# EAGLE design stab12V (EAGLE 5.05)
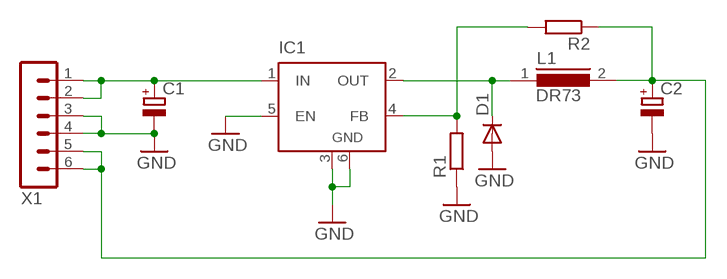
[diagram p0: schematic, sheet 1]

## Parts
C1  CPOL-EUSMCD  [SMC_D]
C2  CPOL-EUSMCD  [SMC_D]
D1  DIODE-SMC  [SMC]
IC1  LM2596S  [TO263-5]
L1  DR73  [DR73]
R1  R-EU_R0805  [R0805]
R2  R-EU_R0805  [R0805]
X1  MA06-1  [MA06-1]

## Nets
GND: C1.- C2.- D1.A IC1.3(GND) IC1.5(EN) IC1.6(GND) R1.1 X1.3 X1.4
N$1: C1.+ IC1.1(IN) X1.1 X1.2
N$2: IC1.4(FB) R1.2 R2.2
N$3: C2.+ L1.2 R2.1 X1.5 X1.6
N$4: D1.C IC1.2(OUT) L1.1

## Library data of the parts
C1 C2 = rcl:CPOL-EU: POLARIZED CAPACITOR, European symbol
D1 = diode:DIODE-: DIODE
IC1 = linear:LM2596S: STEP-DOWN VOLTAGE REGULATOR
L1 = inductors:DR73: High Power Density, High Efficiency, Shielded Inductors Source: coiltronics_dr_series.pdf
R1 R2 = rcl:R-EU_: RESISTOR, European symbol
X1 = con-lstb:MA06-1: PIN HEADER

## Board
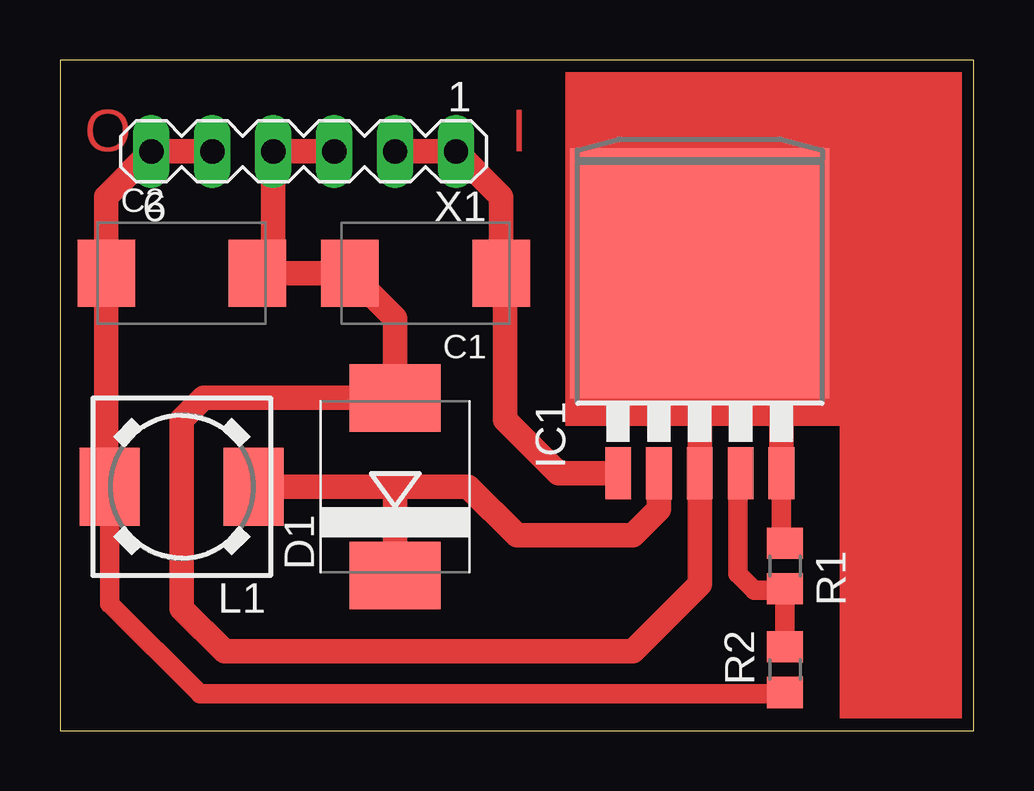
[diagram p1: board, top side]

Size 38.1 x 27.94 mm. Coordinates in mm from the lower left corner, seen from the top.
Outline: 0,0 38.1,0 38.1,27.94 0,27.94 0,0
Copper layers (1*16): Top 0.035mm / dielectric 1.5mm / Bottom 0.035mm
Design rules "default": minimum track width 10mil, minimum drill 24mil, track to track 8mil, track to pad 8mil, pad to pad 8mil, via to via 8mil, smd to smd 8mil, copper to edge 40mil, drill to drill 8mil, minimum pad ring 10mil, minimum via ring 8mil, stop-mask expansion 4mil, vias tented up to drill 0mil, thermal gap 10mil

### Footprints (pad centres in the part's own frame; a part is rotated, then mirrored left to right if it is on the bottom)
SMC_D = smd 2.4 x 2.8: + -3.15,0; - 3.15,0
SMC = smd 2.8 x 3.8: A 3.7,0; C -3.7,0
TO263-5 = smd 1.067 x 2.159: 1 -3.404,-5.791; 2 -1.702,-5.791; 3 0,-5.791; 4 1.702,-5.791; 5 3.404,-5.791 | smd 10.8 x 10.41: 6 0,2.54
DR73 = smd 2.5 x 3.25: 1 -3,0; 2 3,0
R0805 = smd 1.3 x 1.5: 1 -0.95,0; 2 0.95,0
MA06-1 = drill 1.016 long: 1 -6.35,0; 2 -3.81,0; 3 -1.27,0; 4 1.27,0; 5 3.81,0; 6 6.35,0

### Placement (x,y rotation side)
C1  15.24,19.05 180 top
C2  5.08,19.05 0 top
D1  13.97,10.16 90 top
IC1  26.67,16.51 0 top
L1  5.08,10.16 180 top
R1  30.23,6.86 270 top
R2  30.23,2.54 90 top
X1  10.16,24.13 180 top

### Tracks (layer width: path | path; a pad name or v marks a point on that pad's centre or on a via)
GND
  Top 0.813: IC1.5 30.07,7.96 R1.1
  Top 1.016: C1.- C2.- | C1.- 8.89,19.05 X1.4 X1.3 | C1.- 13.97,17.17 D1.A 5.99,13.86 5.08,12.95 5.08,5.08 6.86,3.3 23.88,3.3 26.67,6.1 IC1.3 IC1.6 29.72,19.05 30.07,18.69 IC1.5
N$1
  Top 1.016: X1.2 X1.1 18.39,22.25 C1.+ 18.54,18.9 18.54,12.95 20.78,10.72 IC1.1
N$2
  Top 0.813: IC1.4 28.26,10.61 28.26,6.54 28.96,5.84 30.16,5.84 R1.2 R2.2
N$3
  Top 0.813: L1.2 2.08,5.29 5.84,1.52 30.16,1.52 R2.1
  Top 1.016: L1.2 1.93,10.31 C2.+ 1.93,22.25 X1.6 X1.5
N$4
  Top 1.016: 10.27,10.16 L1.1 14.22,10.16 | 14.22,10.16 17.02,10.16 19.05,8.13 23.88,8.13 24.97,9.22 IC1.2 | D1.C 13.97,9.91 14.22,10.16
(copper drawn outside any net)
  shapes: Top area x2

### Text on the board
Top: O | I